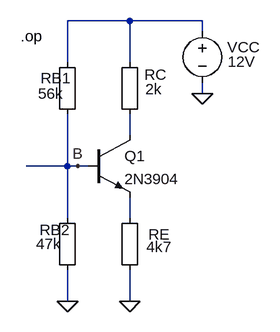
[diagram p0: schematic AMP-CE-DC.asc]
AMP-CE-DC.asc, the LTspice schematic file:
Version 4
SHEET 1 880 680
WIRE 192 -64 96 -64
WIRE 304 -64 192 -64
WIRE 304 -48 304 -64
WIRE 96 0 96 -64
WIRE 192 0 192 -64
WIRE 304 48 304 32
WIRE 192 112 192 80
WIRE 96 160 96 80
WIRE 96 160 32 160
WIRE 112 160 96 160
WIRE 128 160 112 160
WIRE 96 240 96 160
WIRE 192 240 192 208
WIRE 96 368 96 320
WIRE 192 368 192 320
FLAG 304 48 0
FLAG 96 368 0
FLAG 112 160 B
FLAG 192 368 0
SYMBOL npn 128 112 R0
SYMATTR InstName Q1
SYMATTR Value 2N3904
SYMBOL Misc\\EuropeanResistor 80 -16 R0
WINDOW 0 -25 40 Left 2
WINDOW 3 -29 64 Left 2
SYMATTR InstName RB1
SYMATTR Value 56k
SYMBOL Misc\\EuropeanResistor 176 -16 R0
WINDOW 0 39 35 Left 2
WINDOW 3 40 57 Left 2
SYMATTR InstName RC
SYMATTR Value 2k
SYMBOL voltage 304 -64 R0
WINDOW 0 38 41 Left 2
WINDOW 3 39 63 Left 2
WINDOW 123 0 0 Left 2
WINDOW 39 0 0 Left 2
SYMATTR InstName VCC
SYMATTR Value 12V
SYMBOL Misc\\EuropeanResistor 176 224 R0
WINDOW 0 45 41 Left 2
WINDOW 3 42 60 Left 2
SYMATTR InstName RE
SYMATTR Value 4k7
SYMBOL Misc\\EuropeanResistor 80 224 R0
WINDOW 0 -27 34 Left 2
WINDOW 3 -32 56 Left 2
SYMATTR InstName RB2
SYMATTR Value 47k
TEXT 24 -40 Left 2 !.op

The netlist it stands for:
* AMP-CE-DC.asc
Q1 N002 B N003 0 2N3904
RB1 N001 B 56k
RC N001 N002 2k
VCC N001 0 12V
RE N003 0 4k7
RB2 B 0 47k
.model NPN NPN
.model PNP PNP
.lib standard.bjt
.op
.backanno
.end